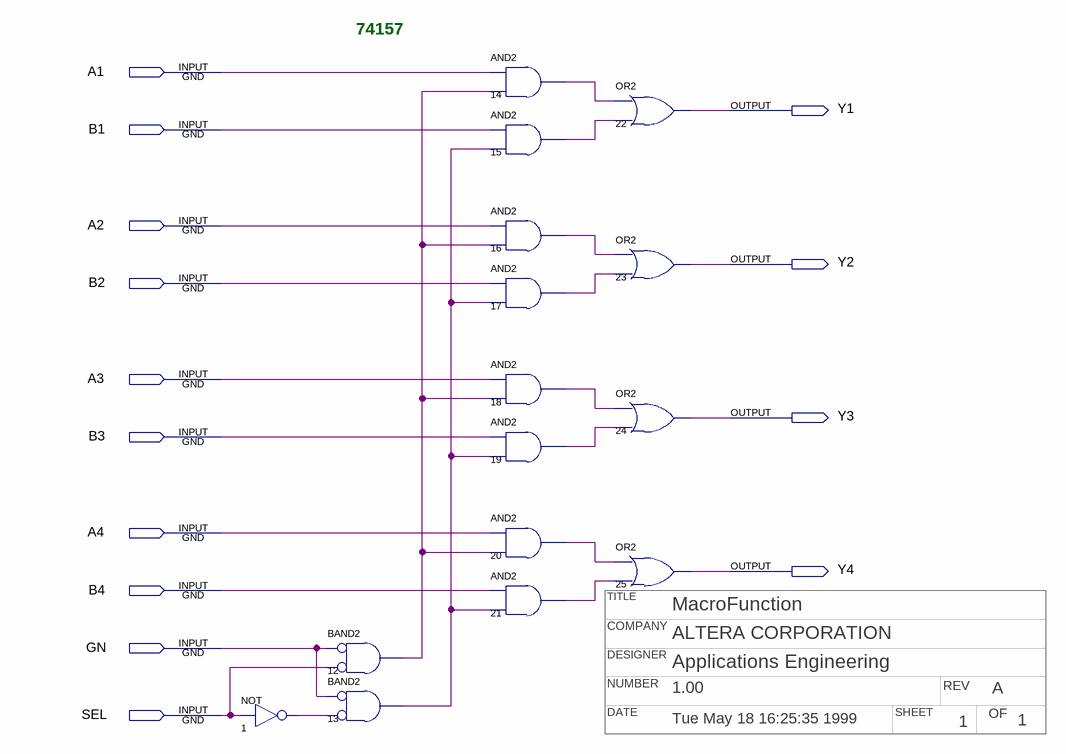
[diagram p0: schematic sheet]
// Quartus schematic 74157.bdf as structural Verilog: 15 symbols, 14 pins
// Title block: TITLE: MacroFunction; COMPANY: ALTERA CORPORATION; DESIGNER: Applications Engineering; NUMBER: 1.00; REV: A; DATE: Tue May 18 16:25:35 1999; SHEET: 1; OF: 1
module \74157  (
  input  A1,
  input  B1,
  input  A2,
  input  B2,
  input  A3,
  input  B3,
  input  A4,
  input  B4,
  input  GN,
  input  SEL,
  output Y1,
  output Y2,
  output Y3,
  output Y4
);

  wire n1_out, n12_out, n13_out, n14_out, n15_out, n16_out, n17_out, n18_out, n19_out, n20_out, n21_out;

  not u_1 (n1_out, SEL);
  and u_12 (n12_out, ~GN, ~SEL);  // BAND2
  and u_13 (n13_out, ~GN, ~n1_out);  // BAND2
  and u_14 (n14_out, A1, n12_out);
  and u_15 (n15_out, B1, n13_out);
  and u_16 (n16_out, A2, n12_out);
  and u_17 (n17_out, B2, n13_out);
  and u_18 (n18_out, A3, n12_out);
  and u_19 (n19_out, B3, n13_out);
  and u_20 (n20_out, A4, n12_out);
  and u_21 (n21_out, B4, n13_out);
  or u_22 (Y1, n14_out, n15_out);
  or u_23 (Y2, n16_out, n17_out);
  or u_24 (Y3, n18_out, n19_out);
  or u_25 (Y4, n20_out, n21_out);

  // Notes on the sheet:
  //   74157
endmodule
